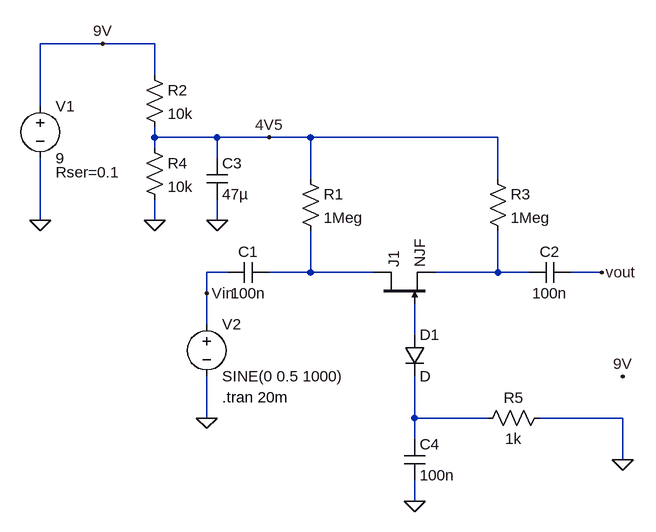
[diagram p0: schematic JFET_Circuit_With_Bypass.asc]
JFET_Circuit_With_Bypass.asc, the LTspice schematic file:
Version 4
SHEET 1 3112 2308
WIRE 48 -304 -48 -304
WIRE 128 -304 48 -304
WIRE 128 -256 128 -304
WIRE -48 -208 -48 -304
WIRE 128 -160 128 -176
WIRE 224 -160 128 -160
WIRE 304 -160 224 -160
WIRE 368 -160 304 -160
WIRE 656 -160 368 -160
WIRE 128 -144 128 -160
WIRE 224 -128 224 -160
WIRE 368 -96 368 -160
WIRE 656 -96 656 -160
WIRE -48 -32 -48 -128
WIRE 128 -32 128 -64
WIRE 224 -32 224 -64
WIRE 240 48 208 48
WIRE 368 48 368 -16
WIRE 368 48 304 48
WIRE 464 48 368 48
WIRE 656 48 656 -16
WIRE 656 48 560 48
WIRE 704 48 656 48
WIRE 816 48 768 48
WIRE 208 80 208 48
WIRE 208 128 208 80
WIRE 528 144 528 96
WIRE 208 272 208 208
WIRE 528 272 528 208
WIRE 640 272 528 272
WIRE 848 272 720 272
WIRE 528 304 528 272
WIRE 848 336 848 272
WIRE 528 400 528 368
FLAG 208 272 0
FLAG -48 -32 0
FLAG 816 48 vout
FLAG 208 80 Vin
FLAG 128 -32 0
FLAG 224 -32 0
FLAG 528 400 0
FLAG 48 -304 9V
FLAG 848 208 9V
FLAG 848 336 0
FLAG 304 -160 4V5
SYMBOL voltage -48 -224 R0
WINDOW 123 0 0 Left 2
WINDOW 39 24 118 Left 2
SYMATTR SpiceLine Rser=0.1
SYMATTR InstName V1
SYMATTR Value 9
SYMBOL voltage 208 112 R0
WINDOW 123 24 124 Left 2
WINDOW 39 0 0 Left 2
SYMATTR InstName V2
SYMATTR Value SINE(0 0.5 1000)
SYMBOL res 352 -112 R0
WINDOW 0 36 40 Left 2
WINDOW 3 36 76 Left 2
SYMATTR InstName R1
SYMATTR Value 1Meg
SYMBOL cap 240 64 R270
WINDOW 0 32 32 VTop 2
WINDOW 3 0 32 VBottom 2
SYMATTR InstName C1
SYMATTR Value 100n
SYMBOL cap 704 64 R270
WINDOW 0 32 32 VTop 2
WINDOW 3 0 32 VBottom 2
SYMATTR InstName C2
SYMATTR Value 100n
SYMBOL res 640 -112 R0
WINDOW 0 36 40 Left 2
WINDOW 3 36 76 Left 2
SYMATTR InstName R3
SYMATTR Value 1Meg
SYMBOL res 112 -272 R0
WINDOW 0 36 40 Left 2
WINDOW 3 36 76 Left 2
SYMATTR InstName R2
SYMATTR Value 10k
SYMBOL res 112 -160 R0
WINDOW 0 36 40 Left 2
WINDOW 3 36 76 Left 2
SYMATTR InstName R4
SYMATTR Value 10k
SYMBOL cap 208 -128 R0
SYMATTR InstName C3
SYMATTR Value 47µ
SYMBOL njf 464 96 R270
SYMATTR InstName J1
SYMBOL diode 512 144 R0
SYMATTR InstName D1
SYMBOL cap 512 304 R0
SYMATTR InstName C4
SYMATTR Value 100n
SYMBOL res 736 256 R90
WINDOW 0 0 56 VBottom 2
WINDOW 3 32 56 VTop 2
SYMATTR InstName R5
SYMATTR Value 1k
TEXT 232 240 Left 2 !.tran 20m

The netlist it stands for:
* JFET_Circuit_With_Bypass.asc
V1 9V 0 9 Rser=0.1
V2 Vin 0 SINE(0 0.5 1000)
R1 4V5 N001 1Meg
C1 Vin N001 100n
C2 N002 vout 100n
R3 4V5 N002 1Meg
R2 9V 4V5 10k
R4 4V5 0 10k
C3 4V5 0 47µ
J1 N001 N003 N002 NJF
D1 N003 N004 D
C4 N004 0 100n
R5 0 N004 1k
.model D D
.lib standard.dio
.model NJF NJF
.model PJF PJF
.lib standard.jft
.tran 20m
.backanno
.end